# EAGLE schematic Hodiny4.5 ESP32 (EAGLE 9.1.3)
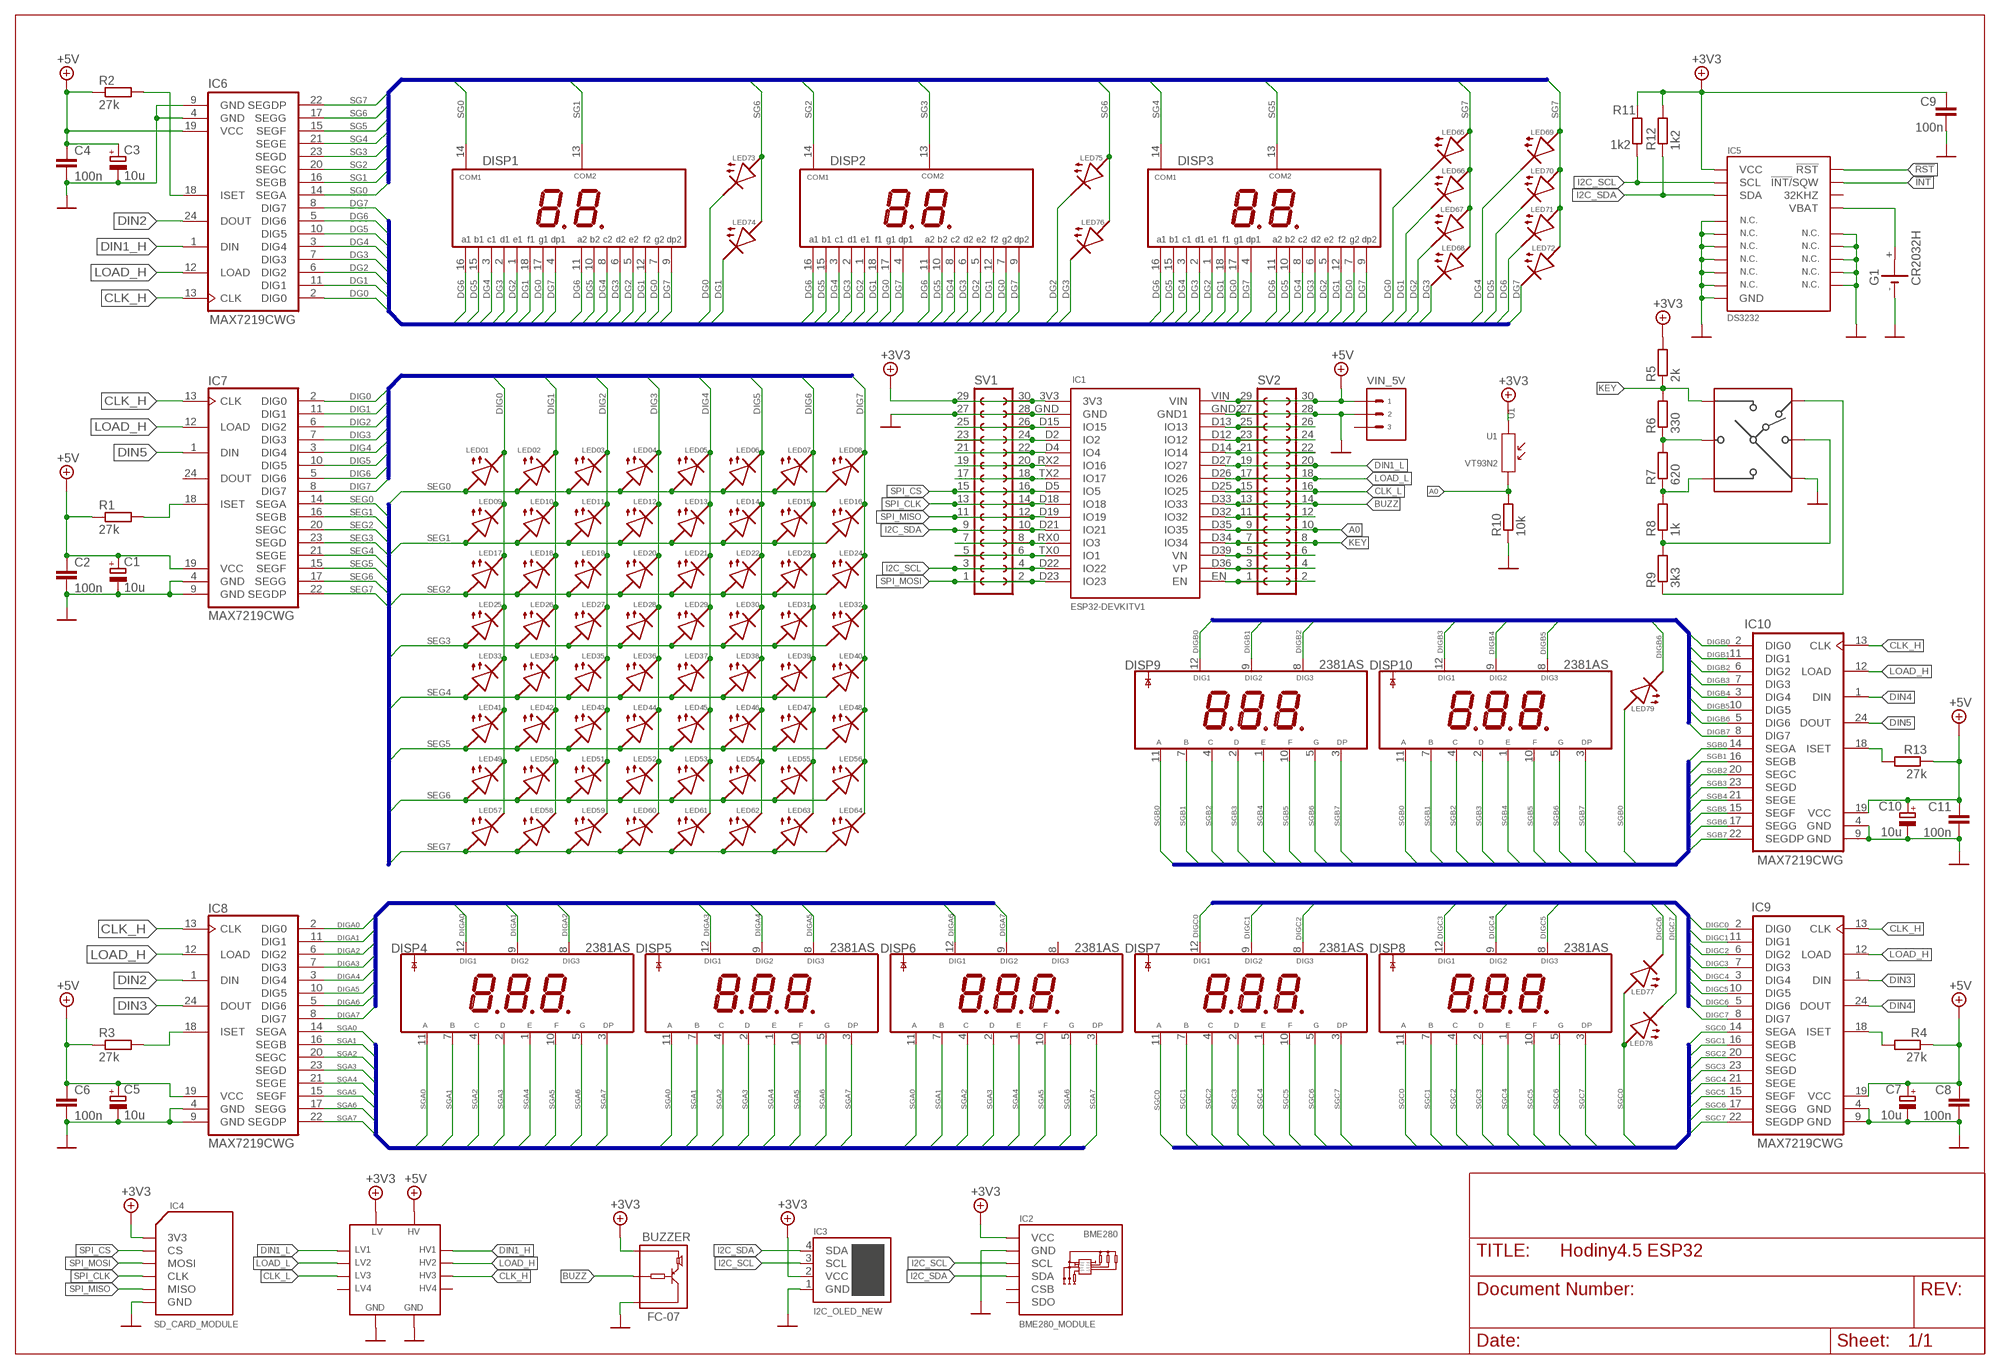
[diagram p0: schematic, sheet 1]

## Parts
C1  10u  CPOL-EUE2.5-5  [E2,5-5]
C2  100n  C-EU050-024X044  [C050-024X044]
C3  10u  CPOL-EUE2.5-5  [E2,5-5]
C4  100n  C-EU050-024X044  [C050-024X044]
C5  10u  CPOL-EUE2.5-5  [E2,5-5]
C6  100n  C-EU050-024X044  [C050-024X044]
C7  10u  CPOL-EUE2.5-5  [E2,5-5]
C8  100n  C-EU050-024X044  [C050-024X044]
C9  100n  C_EU  [C050-024X044]
C10  10u  CPOL-EUE2.5-5  [E2,5-5]
C11  100n  C-EU050-024X044  [C050-024X044]
DISP1  DA08-11  [DA08-11EWA]
DISP2  DA08-11  [DA08-11EWA]
DISP3  DA08-11  [DA08-11EWA]
DISP4  2381AS  [2381AS]
DISP5  2381AS  [2381AS]
DISP6  2381AS  [2381AS]
DISP7  2381AS  [2381AS]
DISP8  2381AS  [2381AS]
DISP9  2381AS  [2381AS]
DISP10  2381AS  [2381AS]
G1  CR2032H  [CR2032H]
IC1  ESP32DEVKITV1NEW  [ESP32-DEVKITV1A]
IC2  BME280_MODULE  [BME280_MODULE]
IC3  I2C_OLED_NEW  [I2C_OLED_PACKAGE]
IC4  SD_CARD_MODULE  [SD_CARD]
IC5  DS3232  [SO20L]
IC6  MAX7219CWG  [SO24L]
IC7  MAX7219CWG  [SO24L]
IC8  MAX7219CWG  [SO24L]
IC9  MAX7219CWG  [SO24L]
IC10  MAX7219CWG  [SO24L]
LED01  LED_45  [LED3MM]
LED02  LED_45  [LED3MM]
LED03  LED_45  [LED3MM]
LED04  LED_45  [LED3MM]
LED05  LED_45  [LED3MM]
LED06  LED_45  [LED3MM]
LED07  LED_45  [LED3MM]
LED08  LED_45  [LED3MM]
LED09  LED_45  [LED3MM]
LED10  LED_45  [LED3MM]
LED11  LED_45  [LED3MM]
LED12  LED_45  [LED3MM]
LED13  LED_45  [LED3MM]
LED14  LED_45  [LED3MM]
LED15  LED_45  [LED3MM]
LED16  LED_45  [LED3MM]
LED17  LED_45  [LED3MM]
LED18  LED_45  [LED3MM]
LED19  LED_45  [LED3MM]
LED20  LED_45  [LED3MM]
LED21  LED_45  [LED3MM]
LED22  LED_45  [LED3MM]
LED23  LED_45  [LED3MM]
LED24  LED_45  [LED3MM]
LED25  LED_45  [LED3MM]
LED26  LED_45  [LED3MM]
LED27  LED_45  [LED3MM]
LED28  LED_45  [LED3MM]
LED29  LED_45  [LED3MM]
LED30  LED_45  [LED3MM]
LED31  LED_45  [LED3MM]
LED32  LED_45  [LED3MM]
LED33  LED_45  [LED3MM]
LED34  LED_45  [LED3MM]
LED35  LED_45  [LED3MM]
LED36  LED_45  [LED3MM]
LED37  LED_45  [LED3MM]
LED38  LED_45  [LED3MM]
LED39  LED_45  [LED3MM]
LED40  LED_45  [LED3MM]
LED41  LED_45  [LED3MM]
LED42  LED_45  [LED3MM]
LED43  LED_45  [LED3MM]
LED44  LED_45  [LED3MM]
LED45  LED_45  [LED3MM]
LED46  LED_45  [LED3MM]
LED47  LED_45  [LED3MM]
LED48  LED_45  [LED3MM]
LED49  LED_45  [LED3MM]
LED50  LED_45  [LED3MM]
LED51  LED_45  [LED3MM]
LED52  LED_45  [LED3MM]
LED53  LED_45  [LED3MM]
LED54  LED_45  [LED3MM]
LED55  LED_45  [LED3MM]
LED56  LED_45  [LED3MM]
LED57  LED_45  [LED3MM]
LED58  LED_45  [LED3MM]
LED59  LED_45  [LED3MM]
LED60  LED_45  [LED3MM]
LED61  LED_45  [LED3MM]
LED62  LED_45  [LED3MM]
LED63  LED_45  [LED3MM]
LED64  LED_45  [LED3MM]
LED65  LED_45  [LED3MM]
LED66  LED_45  [LED3MM]
LED67  LED_45  [LED3MM]
LED68  LED_45  [LED3MM]
LED69  LED_45  [LED3MM]
LED70  LED_45  [LED3MM]
LED71  LED_45  [LED3MM]
LED72  LED_45  [LED3MM]
LED73  LED_45  [LED3MM]
LED74  LED_45  [LED3MM]
LED75  LED_45  [LED3MM]
LED76  LED_45  [LED3MM]
LED77  LED_45  [LED3MM]
LED78  LED_45  [LED3MM]
LED79  LED_45  [LED3MM]
LEVEL_SHIFTER  LEVEL_SHIFTER_4  [LVS_4]
R1  27k  R_EU0207/10  [0207/10]
R2  27k  R_EU0207/10  [0207/10]
R3  27k  R_EU0207/10  [0207/10]
R4  27k  R_EU0207/10  [0207/10]
R5  2k  R_EU0207/10  [0207/10]
R6  330  R_EU0207/10  [0207/10]
R7  620  R_EU0207/10  [0207/10]
R8  1k  R_EU0207/10  [0207/10]
R9  3k3  R_EU0207/10  [0207/10]
R10  10k  R_EU0207/10  [0207/10]
R11  1k2  R_EU0207/10  [0207/10]
R12  1k2  R_EU0207/10  [0207/10]
R13  27k  R_EU0207/10  [0207/10]
SV1  FE15-2  [FE15-2]
SV2  FE15-2  [FE15-2]
SWITCH  5-WAY-SWITCH  [5-WAY-SWITCH]
U1  VT93N2  PHOTORESISTOR-5528-10K(2P-5.0X4.2MM)  [SNR2-3.0]
U$2  BUZZER_FC-07  [BUZZER]
VIN_5V  22-27-2031-03  [6410-03]

## Nets
3V3: C9.1 IC1.3V3 IC2.VCC IC3.2(VCC) IC4.3V3 IC5.4(VCC) LEVEL_SHIFTER.3(LV) R5.2 R11.2 R12.2 SV1.29 SV1.30 U1.1 U$2.VCC ; supply symbol labelled +3V3
!INT: IC5.5(!INT/!SQW)
!RST: IC5.6(!RST)
+5V: C1.+ C2.1 C3.+ C4.1 C5.+ C6.1 C7.+ C8.1 C10.+ C11.1 IC1.VIN IC6.19(VCC) IC7.19(VCC) IC8.19(VCC) IC9.19(VCC) IC10.19(VCC) LEVEL_SHIFTER.10(HV) R1.1 R2.1 R3.1 R4.1 R13.1 SV2.29 SV2.30 VIN_5V.1(-1)
A0: IC1.D35(IO35) R10.2 SV2.9 SV2.10 U1.2
BUZZ: IC1.D33(IO33) SV2.13 SV2.14 U$2.IO(IN)
CLK_H: IC6.13(CLK) IC7.13(CLK) IC8.13(CLK) IC9.13(CLK) IC10.13(CLK) LEVEL_SHIFTER.8(HV3)
CLK_L: IC1.D25(IO25) LEVEL_SHIFTER.5(LV3) SV2.15 SV2.16
DG0: DISP1.7(G2) DISP1.17(G1) DISP2.7(G2) DISP2.17(G1) DISP3.7(G2) DISP3.17(G1) IC6.2(DIG0) LED65.K(C) LED73.K(C)
DG1: DISP1.12(F2) DISP1.18(F1) DISP2.12(F2) DISP2.18(F1) DISP3.12(F2) DISP3.18(F1) IC6.11(DIG1) LED66.K(C) LED74.K(C)
DG2: DISP1.1(E1) DISP1.5(E2) DISP2.1(E1) DISP2.5(E2) DISP3.1(E1) DISP3.5(E2) IC6.6(DIG2) LED67.K(C) LED75.K(C)
DG3: DISP1.2(D1) DISP1.6(D2) DISP2.2(D1) DISP2.6(D2) DISP3.2(D1) DISP3.6(D2) IC6.7(DIG3) LED68.K(C) LED76.K(C)
DG4: DISP1.3(C1) DISP1.8(C2) DISP2.3(C1) DISP2.8(C2) DISP3.3(C1) DISP3.8(C2) IC6.3(DIG4) LED69.K(C)
DG5: DISP1.10(B2) DISP1.15(B1) DISP2.10(B2) DISP2.15(B1) DISP3.10(B2) DISP3.15(B1) IC6.10(DIG5) LED70.K(C)
DG6: DISP1.11(A2) DISP1.16(A1) DISP2.11(A2) DISP2.16(A1) DISP3.11(A2) DISP3.16(A1) IC6.5(DIG6) LED71.K(C)
DG7: DISP1.4(DP1) DISP1.9(DP2) DISP2.4(DP1) DISP2.9(DP2) DISP3.4(DP1) DISP3.9(DP2) IC6.8(DIG7) LED72.K(C)
DIG0: IC7.2(DIG0) LED01.K(C) LED09.K(C) LED17.K(C) LED25.K(C) LED33.K(C) LED41.K(C) LED49.K(C) LED57.K(C)
DIG1: IC7.11(DIG1) LED02.K(C) LED10.K(C) LED18.K(C) LED26.K(C) LED34.K(C) LED42.K(C) LED50.K(C) LED58.K(C)
DIG2: IC7.6(DIG2) LED03.K(C) LED11.K(C) LED19.K(C) LED27.K(C) LED35.K(C) LED43.K(C) LED51.K(C) LED59.K(C)
DIG3: IC7.7(DIG3) LED04.K(C) LED12.K(C) LED20.K(C) LED28.K(C) LED36.K(C) LED44.K(C) LED52.K(C) LED60.K(C)
DIG4: IC7.3(DIG4) LED05.K(C) LED13.K(C) LED21.K(C) LED29.K(C) LED37.K(C) LED45.K(C) LED53.K(C) LED61.K(C)
DIG5: IC7.10(DIG5) LED06.K(C) LED14.K(C) LED22.K(C) LED30.K(C) LED38.K(C) LED46.K(C) LED54.K(C) LED62.K(C)
DIG6: IC7.5(DIG6) LED07.K(C) LED15.K(C) LED23.K(C) LED31.K(C) LED39.K(C) LED47.K(C) LED55.K(C) LED63.K(C)
DIG7: IC7.8(DIG7) LED08.K(C) LED16.K(C) LED24.K(C) LED32.K(C) LED40.K(C) LED48.K(C) LED56.K(C) LED64.K(C)
DIGA0: DISP4.12(DIG1) IC8.2(DIG0)
DIGA1: DISP4.9(DIG2) IC8.11(DIG1)
DIGA2: DISP4.8(DIG3) IC8.6(DIG2)
DIGA3: DISP5.12(DIG1) IC8.7(DIG3)
DIGA4: DISP5.9(DIG2) IC8.3(DIG4)
DIGA5: DISP5.8(DIG3) IC8.10(DIG5)
DIGA6: DISP6.12(DIG1) IC8.5(DIG6)
DIGA7: DISP6.9(DIG2) IC8.8(DIG7)
DIGB0: DISP9.12(DIG1) IC10.2(DIG0)
DIGB1: DISP9.9(DIG2) IC10.11(DIG1)
DIGB2: DISP9.8(DIG3) IC10.6(DIG2)
DIGB3: DISP10.12(DIG1) IC10.7(DIG3)
DIGB4: DISP10.9(DIG2) IC10.3(DIG4)
DIGB5: DISP10.8(DIG3) IC10.10(DIG5)
DIGB6: IC10.5(DIG6) LED79.K(C)
DIGB7: IC10.8(DIG7)
DIGC0: DISP7.12(DIG1) IC9.2(DIG0)
DIGC1: DISP7.9(DIG2) IC9.11(DIG1)
DIGC2: DISP7.8(DIG3) IC9.6(DIG2)
DIGC3: DISP8.12(DIG1) IC9.7(DIG3)
DIGC4: DISP8.9(DIG2) IC9.3(DIG4)
DIGC5: DISP8.8(DIG3) IC9.10(DIG5)
DIGC6: IC9.5(DIG6) LED77.K(C)
DIGC7: IC9.8(DIG7) LED78.K(C)
DIN1_H: IC6.1(DIN) LEVEL_SHIFTER.12(HV1)
DIN1_L: IC1.D27(IO27) LEVEL_SHIFTER.1(LV1) SV2.19 SV2.20
DIN2: IC6.24(DOUT) IC8.1(DIN)
DIN3: IC8.24(DOUT) IC9.1(DIN)
DIN4: IC9.24(DOUT) IC10.1(DIN)
DIN5: IC7.1(DIN) IC10.24(DOUT)
GND: C1.- C2.2 C3.- C4.2 C5.- C6.2 C7.- C8.2 C9.2 C10.- C11.2 G1.- IC1.GND IC1.GND2(GND1) IC2.GND IC3.1(GND) IC4.GND IC5.1(N.C._1) IC5.2(N.C._2) IC5.7(N.C._3) IC5.8(N.C._4) IC5.9(N.C._5) IC5.10(N.C._6) IC5.11(N.C._7) IC5.12(N.C._8) IC5.13(N.C._9) IC5.14(N.C._10) IC5.15(GND) IC5.19(N.C._11) IC6.4(GND) IC6.9(GND) IC7.4(GND) IC7.9(GND) IC8.4(GND) IC8.9(GND) IC9.4(GND) IC9.9(GND) IC10.4(GND) IC10.9(GND) LEVEL_SHIFTER.4(GNDL) LEVEL_SHIFTER.9(GNDH) R10.1 SV1.27 SV1.28 SV2.27 SV2.28 SWITCH.4 U$2.GND VIN_5V.2(-2)
I2C_SCL: IC1.D22(IO22) IC2.SCL IC3.3(SCL) IC5.18(SCL) IC5.20(SCL) R11.1 SV1.3 SV1.4
I2C_SDA: IC1.D21(IO21) IC2.SDA IC3.4(SDA) IC5.17(SDA) R12.1 SV1.9 SV1.10
KEY: IC1.D34(IO34) R5.1 R6.2 SV2.7 SV2.8 SWITCH.1
LOAD_H: IC6.12(LOAD) IC7.12(LOAD) IC8.12(LOAD) IC9.12(LOAD) IC10.12(LOAD) LEVEL_SHIFTER.11(HV2)
LOAD_L: IC1.D26(IO26) LEVEL_SHIFTER.2(LV2) SV2.17 SV2.18
N$1: IC6.18(ISET) R2.2
N$2: IC7.18(ISET) R1.2
N$3: IC8.18(ISET) R3.2
N$4: IC9.18(ISET) R4.2
N$5: G1.+ IC5.16(VBAT)
N$6: IC10.18(ISET) R13.2
N$7: IC1.D4(IO4) SV1.21 SV1.22
N$8: R6.1 R7.2 SWITCH.2
N$9: R7.1 R8.2 SWITCH.3
N$10: R8.1 R9.2 SWITCH.5
N$12: R9.1 SWITCH.6
N$27: IC1.D15(IO15) SV1.25 SV1.26
N$29: IC1.TX2(IO17) SV1.17 SV1.18
N$30: IC1.RX0(IO3) SV1.7 SV1.8
N$31: IC1.TX0(IO1) SV1.5 SV1.6
N$32: IC1.D13(IO13) SV2.25 SV2.26
N$33: IC1.D12(IO12) SV2.23 SV2.24
N$34: IC1.D14(IO14) SV2.21 SV2.22
N$35: IC1.D32(IO32) SV2.11 SV2.12
N$38: IC1.D39(VN) SV2.5 SV2.6
N$39: IC1.D36(VP) SV2.3 SV2.4
N$40: IC1.EN SV2.1 SV2.2
RX2: IC1.RX2(IO16) SV1.19 SV1.20
SEG0: IC7.14(SEGA) LED01.A LED02.A LED03.A LED04.A LED05.A LED06.A LED07.A LED08.A
SEG1: IC7.16(SEGB) LED09.A LED10.A LED11.A LED12.A LED13.A LED14.A LED15.A LED16.A
SEG2: IC7.20(SEGC) LED17.A LED18.A LED19.A LED20.A LED21.A LED22.A LED23.A LED24.A
SEG3: IC7.23(SEGD) LED25.A LED26.A LED27.A LED28.A LED29.A LED30.A LED31.A LED32.A
SEG4: IC7.21(SEGE) LED33.A LED34.A LED35.A LED36.A LED37.A LED38.A LED39.A LED40.A
SEG5: IC7.15(SEGF) LED41.A LED42.A LED43.A LED44.A LED45.A LED46.A LED47.A LED48.A
SEG6: IC7.17(SEGG) LED49.A LED50.A LED51.A LED52.A LED53.A LED54.A LED55.A LED56.A
SEG7: IC7.22(SEGDP) LED57.A LED58.A LED59.A LED60.A LED61.A LED62.A LED63.A LED64.A
SG0: DISP1.14(COM1) IC6.14(SEGA)
SG1: DISP1.13(COM2) IC6.16(SEGB)
SG2: DISP2.14(COM1) IC6.20(SEGC)
SG3: DISP2.13(COM2) IC6.23(SEGD)
SG4: DISP3.14(COM1) IC6.21(SEGE)
SG5: DISP3.13(COM2) IC6.15(SEGF)
SG6: IC6.17(SEGG) LED73.A LED74.A LED75.A LED76.A
SG7: IC6.22(SEGDP) LED65.A LED66.A LED67.A LED68.A LED69.A LED70.A LED71.A LED72.A
SGA0: DISP4.11(A) DISP5.11(A) DISP6.11(A) IC8.14(SEGA)
SGA1: DISP4.7(B) DISP5.7(B) DISP6.7(B) IC8.16(SEGB)
SGA2: DISP4.4(C) DISP5.4(C) DISP6.4(C) IC8.20(SEGC)
SGA3: DISP4.2(D) DISP5.2(D) DISP6.2(D) IC8.23(SEGD)
SGA4: DISP4.1(E) DISP5.1(E) DISP6.1(E) IC8.21(SEGE)
SGA5: DISP4.10(F) DISP5.10(F) DISP6.10(F) IC8.15(SEGF)
SGA6: DISP4.5(G) DISP5.5(G) DISP6.5(G) IC8.17(SEGG)
SGA7: DISP4.3(DP) DISP5.3(DP) DISP6.3(DP) IC8.22(SEGDP)
SGB0: DISP9.11(A) DISP10.11(A) IC10.14(SEGA) LED79.A
SGB1: DISP9.7(B) DISP10.7(B) IC10.16(SEGB)
SGB2: DISP9.4(C) DISP10.4(C) IC10.20(SEGC)
SGB3: DISP9.2(D) DISP10.2(D) IC10.23(SEGD)
SGB4: DISP9.1(E) DISP10.1(E) IC10.21(SEGE)
SGB5: DISP9.10(F) DISP10.10(F) IC10.15(SEGF)
SGB6: DISP9.5(G) DISP10.5(G) IC10.17(SEGG)
SGB7: DISP9.3(DP) DISP10.3(DP) IC10.22(SEGDP)
SGC0: DISP7.11(A) DISP8.11(A) IC9.14(SEGA) LED77.A LED78.A
SGC1: DISP7.7(B) DISP8.7(B) IC9.16(SEGB)
SGC2: DISP7.4(C) DISP8.4(C) IC9.20(SEGC)
SGC3: DISP7.2(D) DISP8.2(D) IC9.23(SEGD)
SGC4: DISP7.1(E) DISP8.1(E) IC9.21(SEGE)
SGC5: DISP7.10(F) DISP8.10(F) IC9.15(SEGF)
SGC6: DISP7.5(G) DISP8.5(G) IC9.17(SEGG)
SGC7: DISP7.3(DP) DISP8.3(DP) IC9.22(SEGDP)
SPI_CLK: IC1.D18(IO18) IC4.CLK SV1.13 SV1.14
SPI_CS: IC1.D5(IO5) IC4.CS SV1.15 SV1.16
SPI_MISO: IC1.D19(IO19) IC4.MISO SV1.11 SV1.12
SPI_MOSI: IC1.D23(IO23) IC4.MOSI SV1.1 SV1.2
XX: IC1.D2(IO2) SV1.23 SV1.24
Unconnected: DISP6.8(DIG3) G1.+@1(+) IC2.CSB IC2.SDO IC5.3(32KHZ) IC7.24(DOUT) LEVEL_SHIFTER.6(LV4) LEVEL_SHIFTER.7(HV4) VIN_5V.3(-3)

## Buses
SEG[0..7]
DIG[0..7]
DG[0..7]
SG[0..7]
DIGA[0..7]
SGA[0..7]
DIGB0,DIGB1,DIGB2,DIGB3,DIGB4,DIGB5,DIGB6,DIGB7
SGB0,SGB1,SGB2,SGB3,SGB4,SGB5,SGB6,SGB7
SGC0,SGC1,SGC2,SGC3,SGC4,SGC5,SGC6,SGC7
DIGC0,DIGC1,DIGC2,DIGC3,DIGC4,DIGC5,DIGC6,DIGC7

## Library data of the parts
C1 C3 C5 C7 C10 = resistor:CPOL-EU: POLARIZED CAPACITOR, European symbol
C2 C4 C6 C8 C11 = resistor:C-EU: CAPACITOR, European symbol
C9 = Hodiny4_LIB:C_EU
DISP1-DISP3 = Hodiny4_LIB:DA08-11
DISP4-DISP10 = winner:2381AS
G1 = battery:CR2032H: LI BATTERY Varta
IC1 = ESP32-DEVKITV1:ESP32DEVKITV1
IC2 = Hodiny4_LIB:BME280_MODULE
IC3 = Hodiny4_LIB:I2C_OLED_NEW
IC4 = Hodiny4_LIB:SD_CARD_MODULE
IC5 = Hodiny4_LIB:DS3232: Extremely Accurate I2C RTC with Integrated Crystal and SRAM
IC6-IC10 = winner:MAX7219: LED DISPLAY DRIVER
LED01-LED09 LED10-LED79 = led:LED_45
LEVEL_SHIFTER = Hodiny4_LIB:LEVEL_SHIFTER_4
R1-R13 = Hodiny4_LIB:R_EU
SV1 SV2 = con-lsta:FE15-2: FEMALE HEADER; OC_FARNELL: unknown; OC_NEWARK: unknown
SWITCH = winner:5-WAY-SWITCH
U1 = Seeed-OPL-sensor:PHOTORESISTOR-5528-10K(2P-5.0X4.2MM): 314020017; MPN: PHOTORESISTOR-5528-10K; VALUE: PHOTORESISTOR-5528-10K
U$2 = winner:BUZZER_FC-07
VIN_5V = Hodiny4_LIB:22-?-03: CONNECTOR wire to board 2.54 mm (.1 inch) pitch header; MF: MOLEX; OC_FARNELL: unknown; OC_NEWARK: unknown